# EAGLE design HalfMasters (EAGLE 9.6.2)
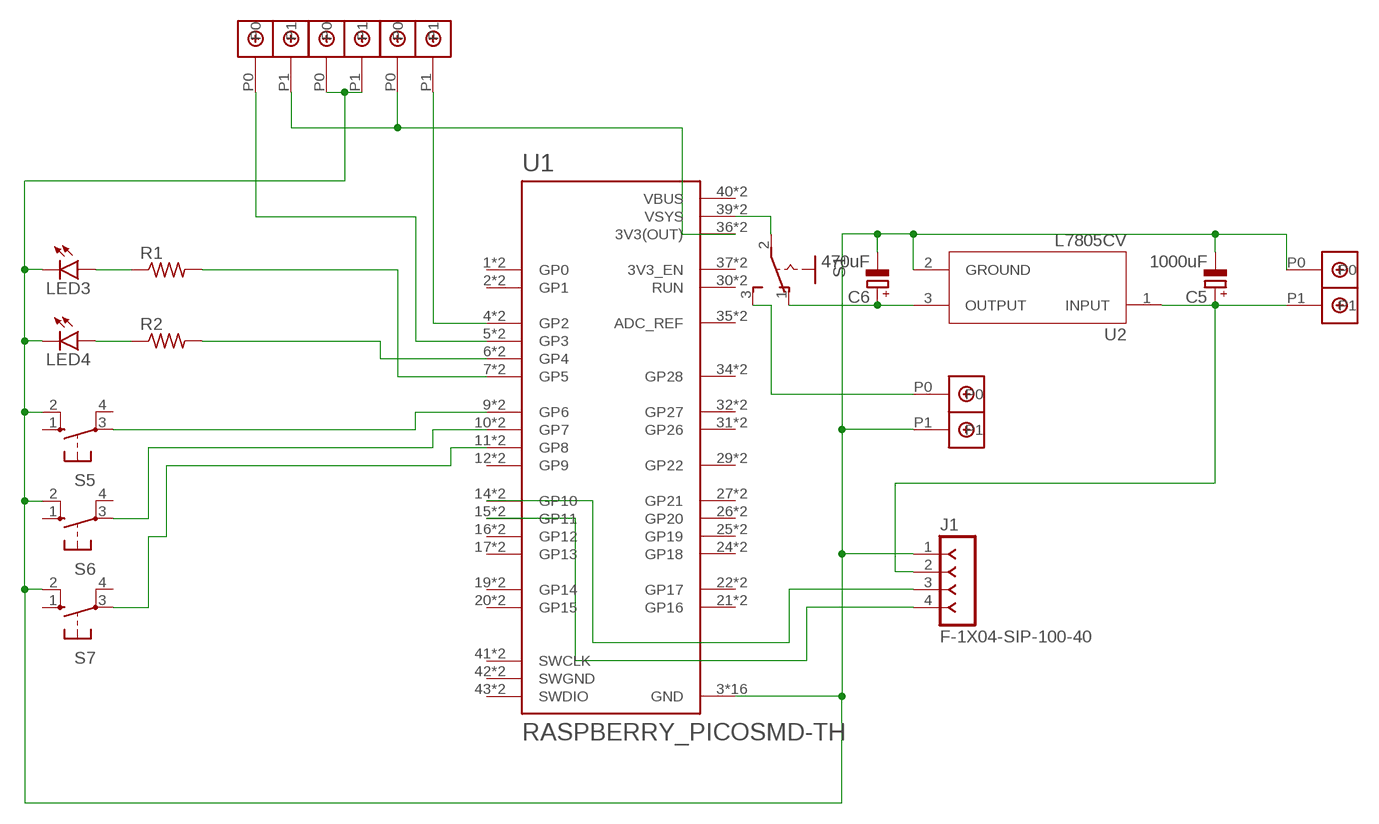
[diagram p0: schematic, sheet 1]

## Parts
C5  1000uF  CPOL-EUE2-5  [E2-5]
C6  470uF  CPOL-EUE2-5  [E2-5]
J1  F-1X04-SIP-100-40  [SIP-100-04-40]
LED3  LED5MM  [LED5MM]
LED4  LED5MM  [LED5MM]
R1  R-US_0207/10  [0207/10]
R2  R-US_0207/10  [0207/10]
S1  255SB  [255SB]
S5  10-XX  [B3F-10XX]
S6  10-XX  [B3F-10XX]
S7  10-XX  [B3F-10XX]
U1  RASPBERRY_PICOSMD-TH  [PICO-PKG]
U2  L7805CV  [TO255P1040X460X1968-3]
U$1  DBCONN-1X2  [DBCONN-1X2]
U$2  DBCONN-1X2  [DBCONN-1X2]
U$3  DBCONN-1X2  [DBCONN-1X2]
U$4  DBCONN-1X2  [DBCONN-1X2]
U$5  DBCONN-1X2  [DBCONN-1X2]

## Nets
N$1: R2.2 U1.6(GP4) U1.P$6(GP4)
N$2: R1.2 U1.7(GP5) U1.P$7(GP5)
N$3: S1.3(S) U$5.P0
N$4: J1.3 U1.14(GP10) U1.P$14(GP10)
N$5: J1.4 U1.15(GP11) U1.P$15(GP11)
N$7: S1.2(P) U1.39(VSYS) U1.P$39(VSYS)
N$18: C6.+ S1.1(O) U2.3(OUTPUT)
N$20: U1.36(3V3(OUT)) U1.P$36(3V3(OUT)) U$1.P1 U$3.P0
N$21: U1.4(GP2) U1.P$4(GP2) U$3.P1
N$22: U1.5(GP3) U1.P$5(GP3) U$1.P0
N$23: LED3.A R1.1
N$25: LED4.A R2.1
N$26: C5.+ J1.2 U2.1(INPUT) U$4.P1
N$27: C5.- C6.- J1.1 LED3.K(C) LED4.K(C) S5.2(S1) S6.2(S1) S7.2(S1) U1.3(GND) U1.8(GND) U1.13(GND) U1.18(GND) U1.23(GND) U1.28(GND) U1.33(GND) U1.38(GND) U1.P$3(GND) U1.P$8(GND) U1.P$13(GND) U1.P$18(GND) U1.P$23(GND) U1.P$28(GND) U1.P$33(GND) U1.P$38(GND) U2.2(GROUND) U$2.P0 U$2.P1 U$4.P0 U$5.P1
N$29: S5.3(P) U1.9(GP6) U1.P$9(GP6)
N$30: S6.3(P) U1.10(GP7) U1.P$10(GP7)
N$31: S7.3(P) U1.11(GP8) U1.P$11(GP8)
Unconnected: S5.1(S) S5.4(P1) S6.1(S) S6.4(P1) S7.1(S) S7.4(P1) U1.1(GP0) U1.2(GP1) U1.12(GP9) U1.16(GP12) U1.17(GP13) U1.19(GP14) U1.20(GP15) U1.21(GP16) U1.22(GP17) U1.24(GP18) U1.25(GP19) U1.26(GP20) U1.27(GP21) U1.29(GP22) U1.30(RUN) U1.31(GP26) U1.32(GP27) U1.34(GP28) U1.35(ADC_REF) U1.37(3V3_EN) U1.41(SWCLK) U1.43(SWDIO) U1.P$1(GP0) U1.P$2(GP1) U1.P$12(GP9) U1.P$16(GP12) U1.P$17(GP13) U1.P$19(GP14) U1.P$20(GP15) U1.P$21(GP16) U1.P$22(GP17) U1.P$24(GP18) U1.P$25(GP19) U1.P$26(GP20) U1.P$27(GP21) U1.P$29(GP22) U1.P$30(RUN) U1.P$31(GP26) U1.P$32(GP27) U1.P$34(GP28) U1.P$35(ADC_REF) U1.P$37(3V3_EN) U1.P$41(SWCLK) U1.P$43(SWDIO)

## Power pins joined to a net without a drawn wire
SWGND: U1.42(SWGND) U1.P$42(SWGND)
VBUS: U1.40(VBUS) U1.P$40(VBUS)

## Library data of the parts
C5 C6 = rcl:CPOL-EU: POLARIZED CAPACITOR, European symbol; SPICEPREFIX: C
J1 = con-headers-jp:F-1X04-: FEMALE HEADER
LED3 LED4 = led:LED: LED OSRAM: - CHIPLED LG R971, LG N971, LY N971, LG Q971, LY Q971, LO R971, LY R971 LH N974, LH R974 LS Q976, LO Q976, LY Q976 LO Q996 - Hyper CHIPLED LW Q18S LB Q993, LB Q99A, LB R99A - SideLED LS A670, LO A670, LY A670, LG A670, LP A670 LB A673, LV A673, LT A673, LW A673 LH A674 LY A675 LS A676, LA A676, LO A676, LY A676, LW A676 LS A679, LY A679, LG A679 - Hyper Micro SIDELED® LS Y876, LA Y876, LO Y876, LY Y876 LT Y87S - SmartLED LW L88C, LW L88S LB L89C, LB L89S, LG L890 LS L89K, LO L89K, LY L89K LS L896, LA L896, LO L896, LY L896 - TOPLED LS T670, LO T670, LY T670, LG T670, LP T670 LSG T670, LSP T670, LSY T670, LOP T670, LYG T670 LG T671, LOG T671, LSG T671 LB T673, LV T673, LT T673, LW T673 LH T674 LS T676, LA T676, LO T676, LY T676, LB T676, LH T676, LSB T676, LW T676 LB T67C, LV T67C, LT T67C, LS T67K, LO T67K, LY T67K, LW E67C LS E67B, LA E67B, LO E67B, LY E67B, LB E67C, LV E67C, LT E67C LW T67C LS T679, LY T679, LG T679 LS T770, LO T770, LY T770, LG T770, LP T770 LB T773, LV T773, LT T773, LW T773 LH T774 LS E675, LA E675, LY E675, LS T675 LS T776, LA T776, LO T776, LY T776, LB T776 LHGB T686 LT T68C, LB T68C - Hyper Mini TOPLED® LB M676 - Mini TOPLED Santana® LG M470 LS M47K, LO M47K, LY M47K Source: http://www.osram.convergy.de LUXEON: - LUMILED® LXK2-PW12-R00, LXK2-PW12-S00, LXK2-PW14-U00, LXK2-PW14-V00 LXK2-PM12-R00, LXK2-PM12-S00, LXK2-PM14-U00 LXK2-PE12-Q00, LXK2-PE12-R00, LXK2-PE12-S00, LXK2-PE14-T00, LXK2-PE14-U00 LXK2-PB12-K00, LXK2-PB12-L00, LXK2-PB12-M00, LXK2-PB14-N00, LXK2-PB14-P00, LXK2-PB14-Q00 LXK2-PR12-L00, LXK2-PR12-M00, LXK2-PR14-Q00, LXK2-PR14-R00 LXK2-PD12-Q00, LXK2-PD12-R00, LXK2-PD12-S00 LXK2-PH12-R00, LXK2-PH12-S00 LXK2-PL12-P00, LXK2-PL12-Q00, LXK2-PL12-R00 Source: www.luxeon.com KINGBRIGHT: KA-3528ASYC Source: www.kingbright.com
R1 R2 = rcl:R-US_: RESISTOR, American symbol; SPICEPREFIX: R
S1 = switch:255SB: SLIDING SWITCH Distributor Buerklin, 11G810
S5-S7 = switch-omron:10-XX: OMRON SWITCH; MPN: B3F-1000; OC_FARNELL: 176432; OC_NEWARK: 36M3542
U1 = RpiPico:RASPBERRY_PICO: Raspberry Pi Pico
U2 = L7805CV:L7805CV: Standard Regulator Pos 5V 1.5A 3-Pin(3+Tab) TO-220 Standard Regulator Pos 5V 1.5A 3-Pin(3+Tab) TO-220 Check availability <https://pricing.snapeda.com/parts/L7805CV/STMicroelectronics/view-part?ref=eda>; AVAILABILITY: In Stock; DESCRIPTION: Linear Voltage Regulator IC Positive Fixed 1 Output 1.5A TO-220; MF: STMicroelectronics; MP: L7805CV; PACKAGE: TO-220-3 ON Semiconductor; PRICE: None; PURCHASE-URL: https://pricing.snapeda.com/search/part/L7805CV/?ref=eda
U$1-U$5 = Terminal Block Connector:DBCONN-1X2

## Board
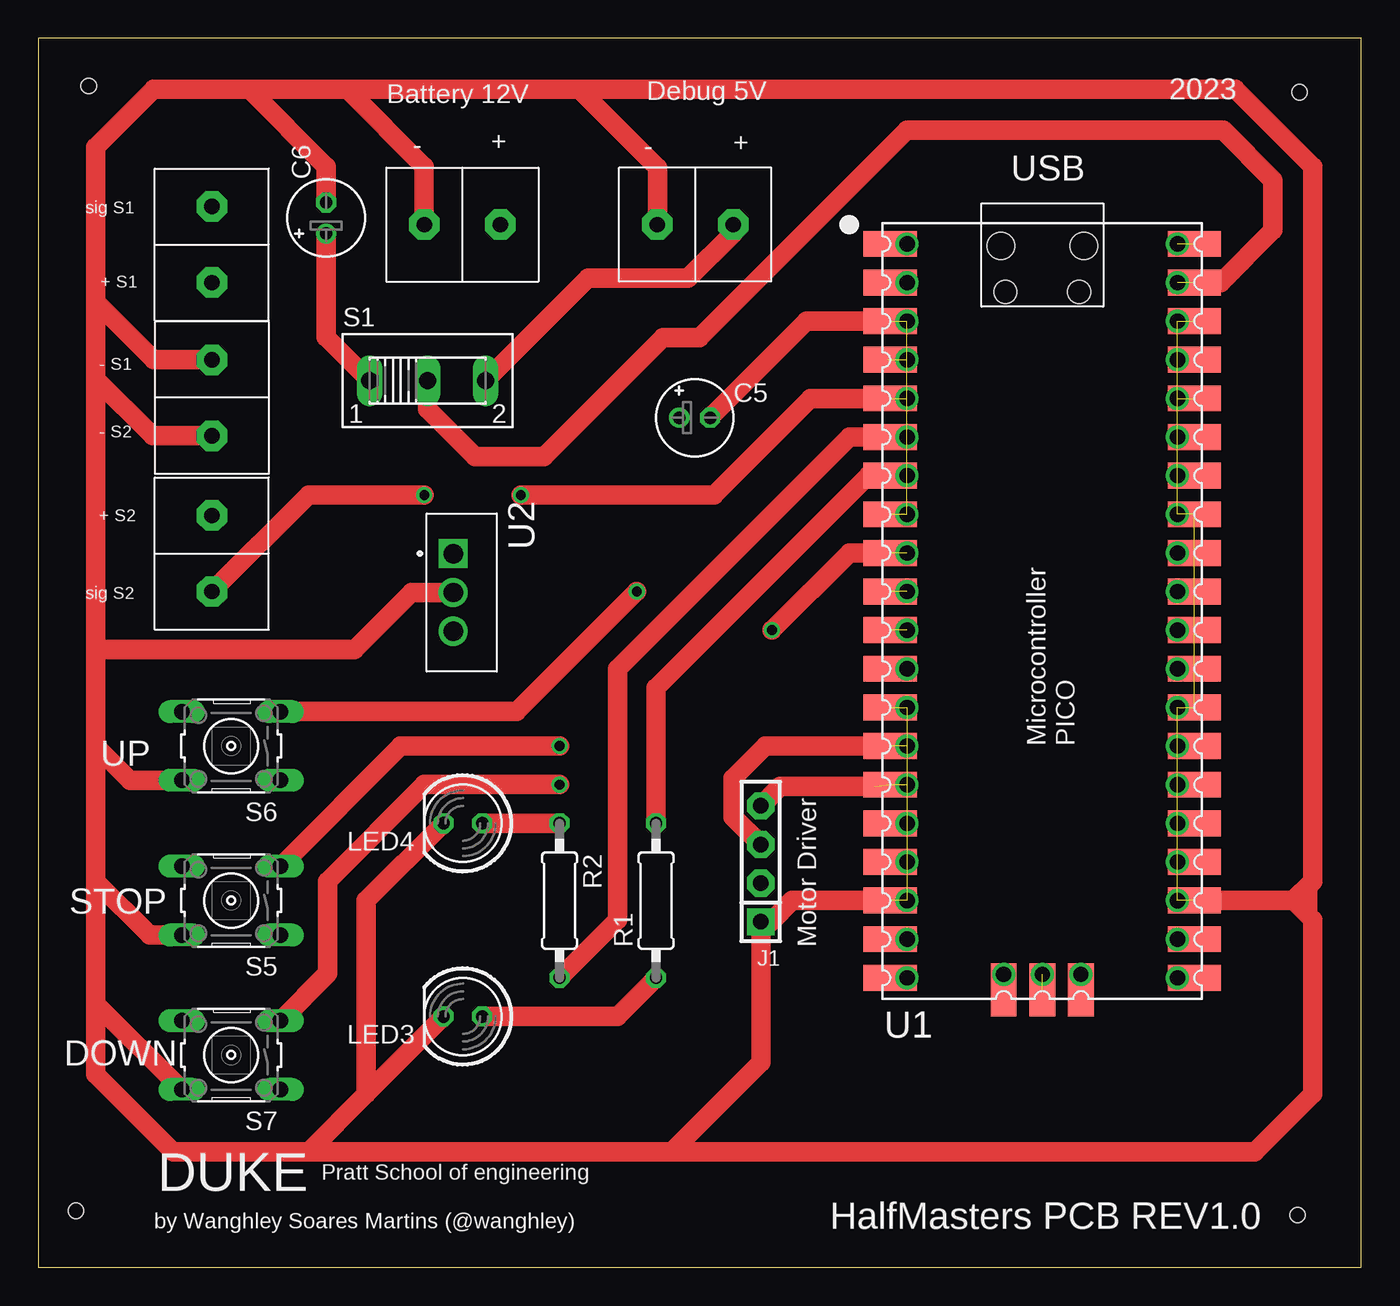
[diagram p1: board, top side]
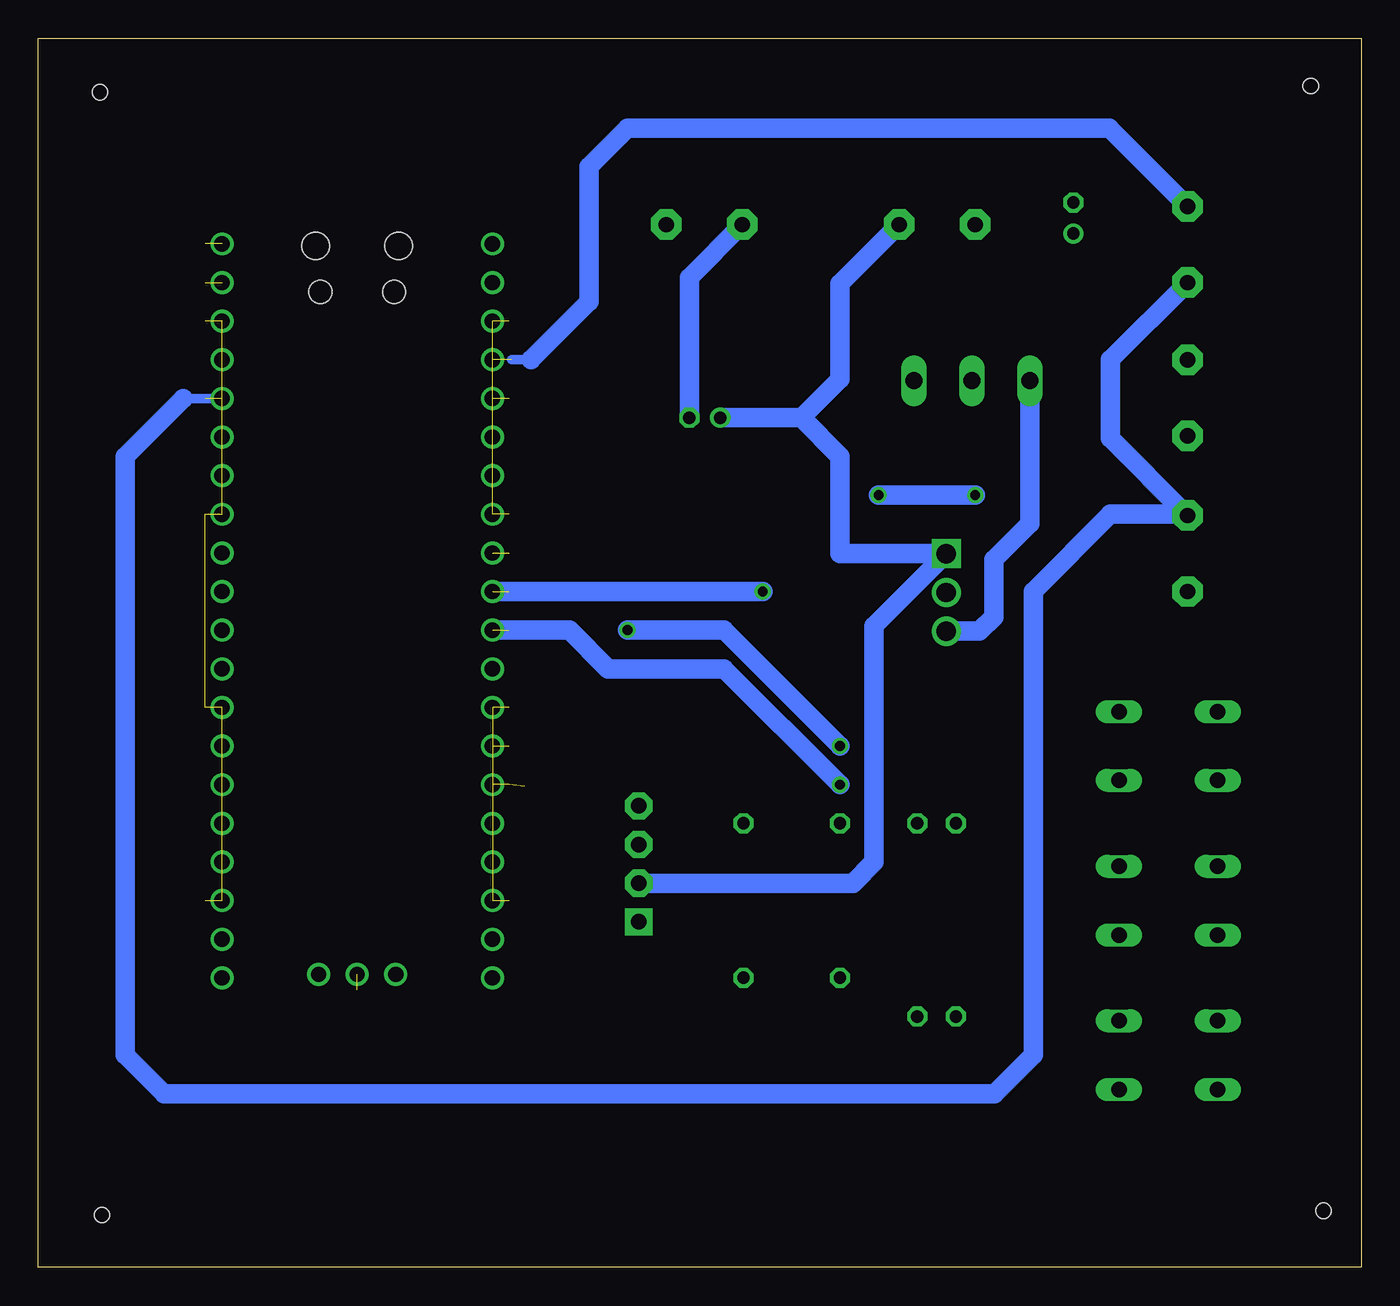
[diagram p2: board, bottom side, seen from below]

Size 87.03 x 80.85 mm. Coordinates in mm from the lower left corner, seen from the top.
Outline: 0,0 87.03,0 87.03,80.85 0,80.85 0,0
Copper layers (1*16): Top 0.035mm / dielectric 1.5mm / Bottom 0.035mm
Design rules "default *": minimum track width 15mil, minimum drill 0.35mm, track to track 6mil, track to pad 6mil, pad to pad 6mil, via to via 6mil, smd to smd 6mil, copper to edge 40mil, drill to drill 6mil, minimum pad ring 10mil, minimum via ring 8mil, stop-mask expansion 4mil, vias tented up to drill 0mil, thermal gap 10mil
Holes 1 mm at 3.33,77.7 82.96,77.29 82.83,3.45 2.49,3.73

### Footprints (pad centres in the part's own frame; a part is rotated, then mirrored left to right if it is on the bottom)
E2-5 = drill 0.813 pad 1.27: + -1.016,0 | drill 0.813 pad 1.27 octagon: - 1.016,0
SIP-100-04-40 = drill 1.016 pad 1.778 square: 1 -3.81,0 | drill 1.016 pad 1.778 octagon: 2 -1.27,0; 3 1.27,0; 4 3.81,0
LED5MM = drill 0.813 octagon: A -1.27,0; K 1.27,0
0207/10 = drill 0.813 octagon: 1 -5.08,0; 2 5.08,0
255SB = drill 1.118 long: 1 -3.81,0; 2 0,0; 3 3.81,0
B3F-10XX = drill 1.016 long: 1 -3.251,2.261; 2 3.251,2.261; 3 -3.251,-2.261; 4 3.251,-2.261
PICO-PKG = drill 1: 1 -8.89,24.13; 2 -8.89,21.59; 3 -8.89,19.05; 4 -8.89,16.51; 5 -8.89,13.97; 6 -8.89,11.43; 7 -8.89,8.89; 8 -8.89,6.35; 9 -8.89,3.81; 10 -8.89,1.27; 11 -8.89,-1.27; 12 -8.89,-3.81; 13 -8.89,-6.35; 14 -8.89,-8.89; 15 -8.89,-11.43; 16 -8.89,-13.97; 17 -8.89,-16.51; 18 -8.89,-19.05; 19 -8.89,-21.59; 20 -8.89,-24.13; 21 8.89,-24.13; 22 8.89,-21.59; 23 8.89,-19.05; 24 8.89,-16.51; 25 8.89,-13.97; 26 8.89,-11.43; 27 8.89,-8.89; 28 8.89,-6.35; 29 8.89,-3.81; 30 8.89,-1.27; 31 8.89,1.27; 32 8.89,3.81; 33 8.89,6.35; 34 8.89,8.89; 35 8.89,11.43; 36 8.89,13.97; 37 8.89,16.51; 38 8.89,19.05; 39 8.89,21.59; 40 8.89,24.13; 41 -2.54,-23.9; 42 0,-23.9; 43 2.54,-23.9 | smd 3.5 x 1.7: P$1 -10,24.13; P$2 -10,21.59; P$3 -10,19.05; P$4 -10,16.51; P$5 -10,13.97; P$6 -10,11.43; P$7 -10,8.89; P$8 -10,6.35; P$9 -10,3.81; P$10 -10,1.27; P$11 -10,-1.27; P$12 -10,-3.81; P$13 -10,-6.35; P$14 -10,-8.89; P$15 -10,-11.43; P$16 -10,-13.97; P$17 -10,-16.51; P$18 -10,-19.05; P$19 -10,-21.59; P$20 -10,-24.13; P$21 10,-24.13; P$22 10,-21.59; P$23 10,-19.05; P$24 10,-16.51; P$25 10,-13.97; P$26 10,-11.43; P$27 10,-8.89; P$28 10,-6.35; P$29 10,-3.81; P$30 10,-1.27; P$31 10,1.27; P$32 10,3.81; P$33 10,6.35; P$34 10,8.89; P$35 10,11.43; P$36 10,13.97; P$37 10,16.51; P$38 10,19.05; P$39 10,21.59; P$40 10,24.13 | smd 1.7 x 3.5: P$41 -2.54,-24.925; P$42 0,-24.925; P$43 2.54,-24.925 | hole 1.8: -2.725,24; 2.725,24 | hole 1.5: -2.425,20.97; 2.425,20.97
TO255P1040X460X1968-3 = drill 1.27 pad 1.91 square: 1 0,0 | drill 1.27 pad 1.91: 2 2.55,0; 3 5.1,0
DBCONN-1X2 = drill 1 pad 2 octagon: P0 -2.54,0; P1 2.46,0

### Placement (x,y rotation side)
C5  43.18,55.88 0 top
C6  18.95,69.01 90 top
J1  47.52,26.54 90 top
LED3  27.94,16.51 180 top
LED4  27.94,29.21 180 top
R1  40.64,24.13 90 top
R2  34.29,24.13 270 top
S1  25.63,58.32 0 top
S5  12.7,24.13 180 top
S6  12.7,34.29 180 top
S7  12.7,13.97 180 top
U1  66.04,43.18 0 top
U2  27.3,46.94 270 top
U$1  11.43,46.99 90 top
U$2  11.43,57.15 270 top
U$3  11.43,67.31 90 top
U$4  27.94,68.58 0 top
U$5  43.18,68.58 180 top

### Tracks (layer width: path | path; a pad name or v marks a point on that pad's centre or on a via)
N$1
  Top 0.61: U1.P$6 U1.6
  Top 1.27: R2.2 38.1,22.86 38.1,39.37 53.34,54.61 U1.6
N$2
  Top 0.61: 54.61,52.07 U1.P$7 U1.7
  Top 1.27: R1.2 40.64,38.1 54.61,52.07
N$3
  Top 1.27: S1.3 36.17,65.05 42.75,65.05 45.72,68.02 U$5.P0
N$4  (1 unrouted)
  Top 1.27: J1.3 45.69,29.64 45.69,32.16 47.83,34.29 U1.14
N$5  (2 unrouted)
  Top 1.27: J1.4 48.79,31.62 55.04,31.62
N$7  (1 unrouted)
  Top 1.27: S1.2 25.63,56.44 28.75,53.31 33.27,53.31 41.1,61.14 43.51,61.14 57.15,74.78 77.93,74.78 81.2,71.5 81.2,68.2 77.78,64.77 U1.P$39
N$18
  Top 1.27: C6.+ 18.95,61.19 S1.1
  Bottom 1.27: S1.1 21.82,48.92 24.18,46.56 24.18,42.77 25.12,41.84 U2.3
N$20  (1 unrouted)
  Bottom 0.61: 11.47,49.49 U$1.P1 11.43,49.53 | U1.36 77.47,57.15
  Bottom 1.27: U$3.P0 16.51,59.69 16.51,54.53 11.47,49.49 | 77.47,57.15 81.28,53.34 81.28,13.97 78.74,11.43 24.13,11.43 21.59,13.97 21.59,44.45 16.51,49.53 11.43,49.53
N$21  (2 unrouted)
  Bottom 0.61: 54.61,59.69 55.88,59.69
  Bottom 1.27: U$3.P1 16.59,74.93 48.26,74.93 50.8,72.39 50.8,63.5 54.61,59.69
N$22  (via drill 0.65)  (1 unrouted)
  Top 1.27: U$1.P0 17.78,50.8 v25.4,50.8 | v31.75,50.8 44.45,50.8 50.8,57.15 U1.P$5
  Bottom 1.27: v25.4,50.8 v31.75,50.8
N$23
  Top 1.27: LED3.A 38.1,16.51 R1.1
N$25
  Top 1.27: LED4.A R2.1
N$26
  Bottom 1.27: U$4.P1 34.29,64.69 34.29,58.42 36.83,55.88 | C5.+ 36.83,55.88 | 36.83,55.88 34.29,53.34 34.29,46.94 U2.1 32.06,42.19 32.06,26.67 33.45,25.27 J1.2
N$27  (13 unrouted)
  Top 0.381: 26.39,16.23 LED3.K
  Top 0.61: 83.82,24.13 83.82,22.86 | 83.82,25.4 83.82,24.13 | U1.P$23 83.82,24.13 | 48.11,22.61 48.03,22.53 47.83,22.73 J1.1 48.18,22.73
  Top 1.27: 41.66,7.62 80.01,7.62 83.82,11.43 83.82,22.86 82.55,24.13 | 41.66,7.62 17.78,7.62 | 17.78,7.62 8.89,7.62 3.81,12.7 3.81,17.35 | 3.81,17.35 3.81,25.4 | 3.81,25.4 3.81,34.29 | 3.81,34.29 3.81,40.64 | 3.81,40.64 3.81,58.42 | 3.81,58.42 3.81,63.5 | 3.81,63.5 3.81,73.66 7.62,77.47 13.87,77.47 | 13.87,77.47 20.32,77.47 | 20.32,77.47 35.56,77.47 | 35.56,77.47 78.74,77.47 83.82,72.39 83.82,25.4 82.55,24.13 | U1.P$23 82.55,24.13 | 3.81,40.64 20.8,40.64 24.55,44.39 U2.2 | S7.2 3.81,17.35 | S5.2 7.34,21.87 3.81,25.4 | S6.2 6.07,32.03 3.81,34.29 | U$2.P1 7.54,54.69 3.81,58.42 | U$2.P0 7.62,59.69 3.81,63.5 | LED4.K 21.59,24.13 21.59,11.43 | 21.59,11.43 17.78,7.62 | LED3.K 21.59,11.43 | U$5.P1 40.72,72.31 35.56,77.47 | U$4.P0 25.4,72.39 20.32,77.47 | C5.- 50.55,62.23 U1.3 | J1.1 47.52,13.49 41.66,7.62 | U1.P$18 49.58,24.13 48.18,22.73 | C6.- 18.95,72.39 13.87,77.47
  Bottom 1.27: C5.- 44.2,65.1 U$5.P1
N$29  (via drill 0.65)  (1 unrouted)
  Top 1.27: S5.3 23.85,34.29 v34.29,34.29 | v48.26,41.91 53.34,46.99 U1.9
  Bottom 1.27: v34.29,34.29 41.91,41.91 v48.26,41.91
N$30  (via drill 0.65)  (1 unrouted)
  Top 1.27: S6.3 31.47,36.55 v39.37,44.45
  Bottom 1.27: v39.37,44.45 U1.10
N$31  (via drill 0.65)  (1 unrouted)
  Top 1.27: S7.3 19.05,19.33 19.05,25.4 25.4,31.75 v34.29,31.75
  Bottom 1.27: v34.29,31.75 41.91,39.37 49.53,39.37 52.07,41.91 U1.11
SWGND  (1 unrouted)
VBUS  (1 unrouted)

### Text on the board
tPlace: by Wanghley Soares Martins (@wanghley) | HalfMasters PCB REV1.0
tNames: Battery 12V | Debug 5V | 2023 | + | + | - | - | USB | sig S1 | + S1 | - S1 | - S2 | + S2 | sig S2 | Microcontroller / PICO | UP | STOP | Motor Driver | DOWN | Pratt School of engineering | DUKE
201bmp: /Users/wanghley/Workspace/Projects/Flag-Pole-Automatic-System/electronics/duke-logo-min (2).bmp